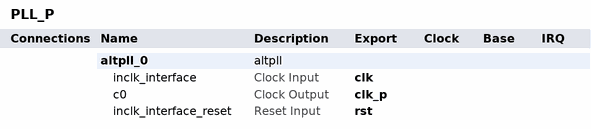
[diagram p0: system contents]
# Platform Designer (Qsys) system PLL_P, Cyclone III EP3C16F484C6
# Parameters at their usual value, and those the tool derives, are not listed.
package require qsys
create_system PLL_P
set_project_property DEVICE_FAMILY {Cyclone III}
set_project_property DEVICE EP3C16F484C6

add_instance altpll_0 altpll 13.0
set_instance_parameter_value altpll_0 INCLK0_INPUT_FREQUENCY 20000
set_instance_parameter_value altpll_0 CLK0_MULTIPLY_BY 20
set_instance_parameter_value altpll_0 CLK0_DIVIDE_BY 1
set_instance_parameter_value altpll_0 PORT_clk1 PORT_UNUSED
set_instance_parameter_value altpll_0 PORT_clk2 PORT_UNUSED
set_instance_parameter_value altpll_0 PORT_clk3 PORT_UNUSED
set_instance_parameter_value altpll_0 PORT_ARESET PORT_UNUSED
set_instance_parameter_value altpll_0 PORT_LOCKED PORT_UNUSED

# exported interfaces
add_interface rst reset sink
set_interface_property rst EXPORT_OF altpll_0.inclk_interface_reset
add_interface clk_p clock source
set_interface_property clk_p EXPORT_OF altpll_0.c0
add_interface clk clock sink
set_interface_property clk EXPORT_OF altpll_0.inclk_interface

set_interconnect_requirement {$system} qsys_mm.clockCrossingAdapter HANDSHAKE
set_interconnect_requirement {$system} qsys_mm.maxAdditionalLatency 1

save_system PLL_P.qsys
